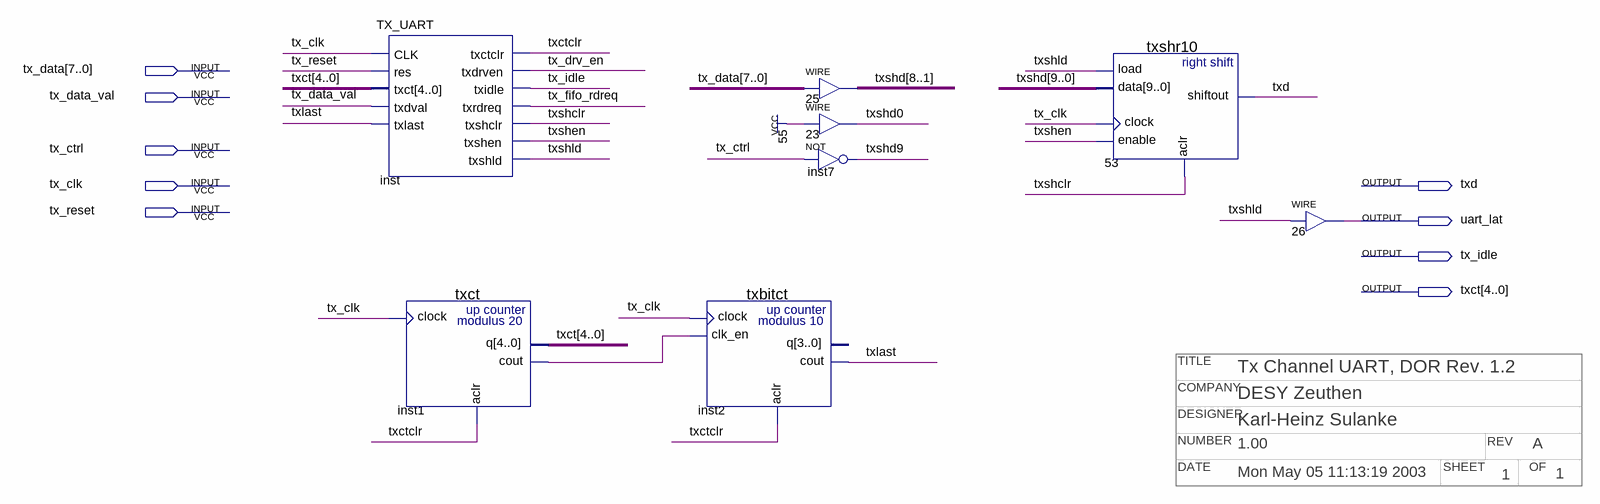
[diagram p0: schematic sheet]
// Quartus schematic tx_uart_12.bdf as structural Verilog: 8 symbols, 9 pins
// Title block: TITLE: Tx Channel UART, DOR Rev. 1.2; COMPANY: DESY Zeuthen; DESIGNER: Karl-Heinz Sulanke; NUMBER: 1.00; REV: A; DATE: Mon May 05 11:13:19 2003; SHEET: 1; OF: 1
module tx_uart_12 (
  input  [7:0] tx_data,
  input  tx_data_val,
  input  tx_ctrl,
  input  tx_clk,
  input  tx_reset,
  output txd,
  output uart_lat,
  output tx_idle,
  output [4:0] txct
);

  wire inst1_cout, tx_drv_en, tx_fifo_rdreq, txctclr, txlast, txshclr, txshen, txshld;
  wire [9:0] txshd;

  TX_UART inst (
    .CLK(tx_clk), .res(tx_reset), .txct(txct), .txdval(tx_data_val), .txlast(txlast), .txctclr(txctclr),
    .txdrven(tx_drv_en), .txidle(tx_idle), .txrdreq(tx_fifo_rdreq), .txshclr(txshclr), .txshen(txshen),
    .txshld(txshld));
  txct inst1 (.clock(tx_clk), .aclr(txctclr), .q(txct), .cout(inst1_cout));
  txbitct inst2 (.clock(tx_clk), .clk_en(inst1_cout), .aclr(txctclr), .cout(txlast));  // open: q
  assign txshd[8:1] = tx_data;  // WIRE 25
  assign txshd[0] = 1'b1;  // WIRE 23
  not inst7 (txshd[9], tx_ctrl);
  txshr10 u_53 (.load(txshld), .data(txshd), .clock(tx_clk), .enable(txshen), .aclr(txshclr), .shiftout(txd));
  assign uart_lat = txshld;  // WIRE 26
endmodule
